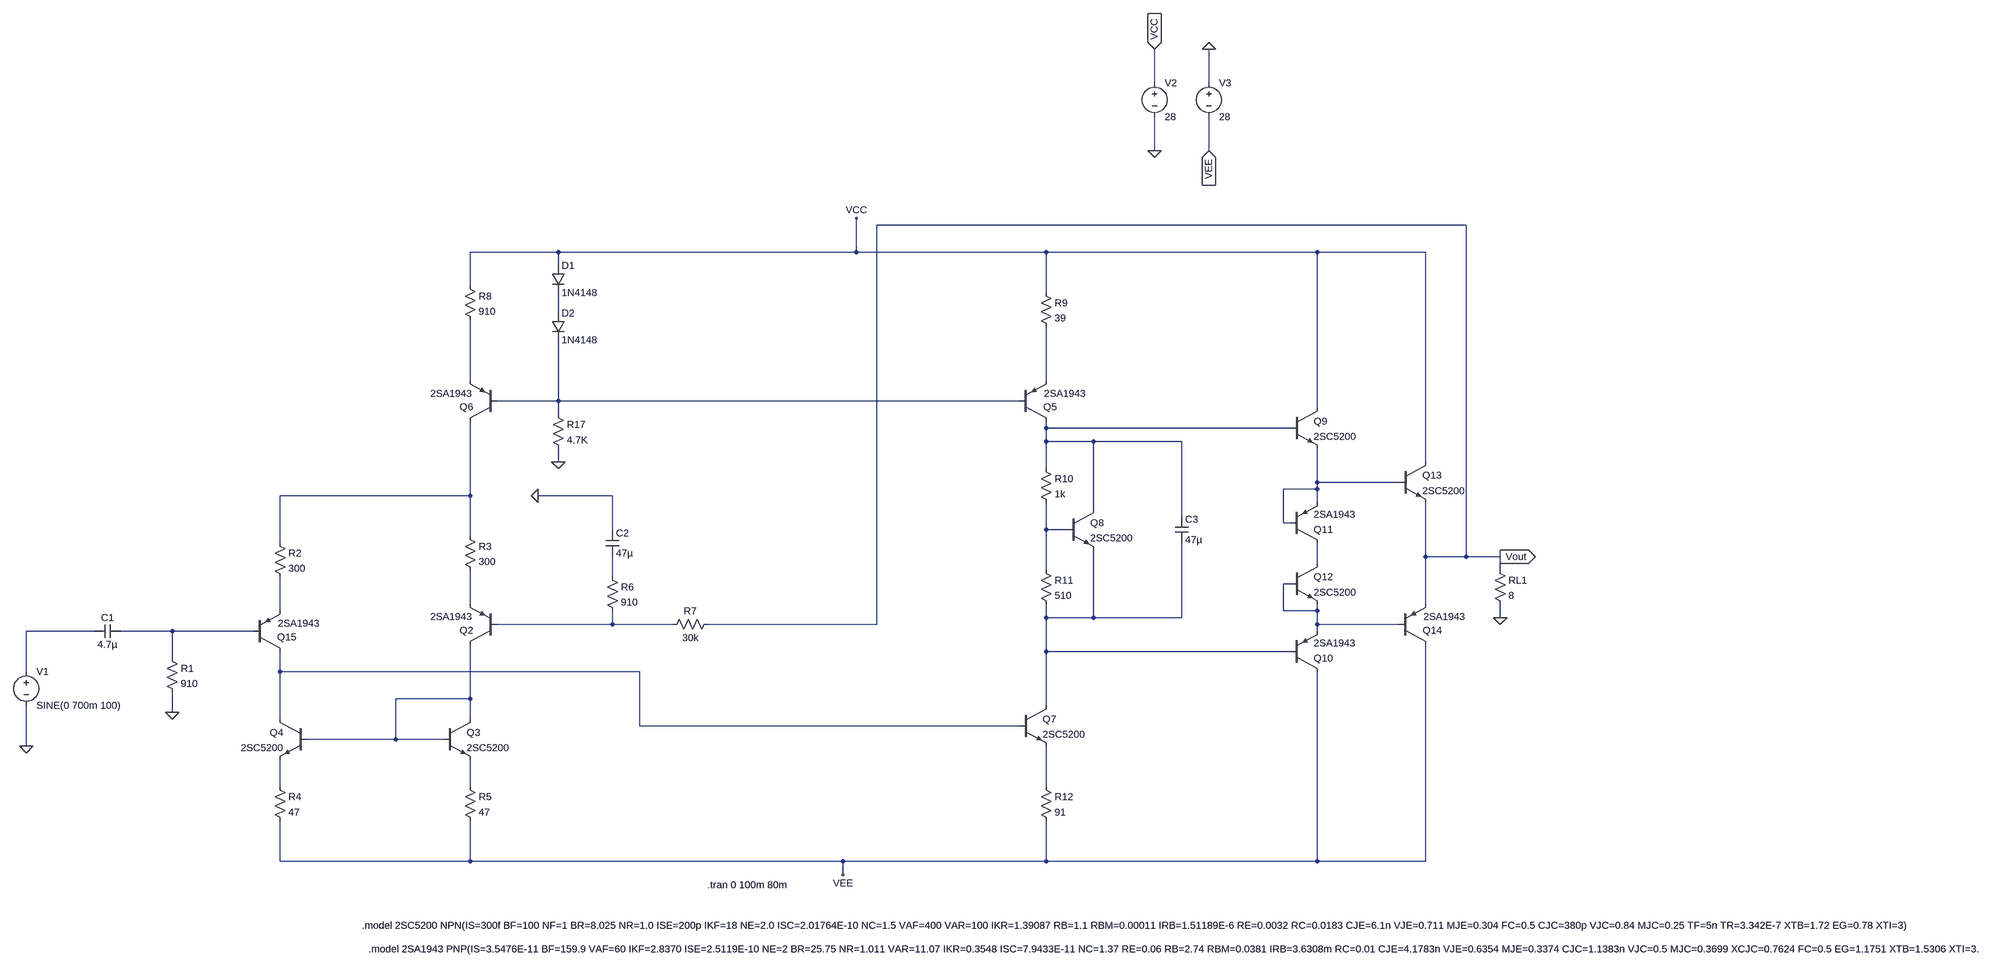
[diagram p0: schematic POWER_AMP_GroupC.asc]
POWER_AMP_GroupC.asc, the LTspice schematic file:
Version 4.1
SHEET 1 5060 688
WIRE 2816 -1376 2816 -1456
WIRE 2944 -1376 2944 -1456
WIRE 2816 -1216 2816 -1296
WIRE 2944 -1216 2944 -1296
WIRE 3552 -1040 2160 -1040
WIRE 1408 -976 1200 -976
WIRE 2112 -976 2112 -1056
WIRE 2112 -976 1408 -976
WIRE 2560 -976 2112 -976
WIRE 3200 -976 2560 -976
WIRE 3456 -976 3200 -976
WIRE 1408 -944 1408 -976
WIRE 1200 -896 1200 -976
WIRE 2560 -880 2560 -976
WIRE 1408 -832 1408 -880
WIRE 1200 -672 1200 -816
WIRE 2560 -672 2560 -800
WIRE 1408 -624 1408 -768
WIRE 1408 -624 1264 -624
WIRE 2496 -624 1408 -624
WIRE 3200 -608 3200 -976
WIRE 1408 -592 1408 -624
WIRE 2560 -560 2560 -576
WIRE 3136 -560 2560 -560
WIRE 2560 -528 2560 -560
WIRE 2672 -528 2560 -528
WIRE 2880 -528 2672 -528
WIRE 1408 -480 1408 -512
WIRE 3456 -480 3456 -976
WIRE 2560 -464 2560 -528
WIRE 3200 -432 3200 -512
WIRE 3392 -432 3200 -432
WIRE 3200 -416 3200 -432
WIRE 3200 -416 3120 -416
WIRE 1200 -400 1200 -576
WIRE 1200 -400 736 -400
WIRE 1536 -400 1360 -400
WIRE 3200 -384 3200 -416
WIRE 2672 -368 2672 -528
WIRE 2880 -352 2880 -528
WIRE 3120 -336 3120 -416
WIRE 3136 -336 3120 -336
WIRE 1536 -320 1536 -400
WIRE 2560 -320 2560 -384
WIRE 2608 -320 2560 -320
WIRE 1200 -304 1200 -400
WIRE 736 -288 736 -400
WIRE 3456 -256 3456 -384
WIRE 3552 -256 3552 -1040
WIRE 3552 -256 3456 -256
WIRE 3632 -256 3552 -256
WIRE 3200 -240 3200 -288
WIRE 2560 -224 2560 -320
WIRE 3632 -224 3632 -256
WIRE 1536 -208 1536 -256
WIRE 3136 -192 3120 -192
WIRE 1200 -144 1200 -224
WIRE 3456 -144 3456 -256
WIRE 736 -128 736 -208
WIRE 3120 -128 3120 -192
WIRE 3200 -128 3200 -144
WIRE 3200 -128 3120 -128
WIRE 2560 -112 2560 -144
WIRE 2672 -112 2672 -272
WIRE 2672 -112 2560 -112
WIRE 2880 -112 2880 -288
WIRE 2880 -112 2672 -112
WIRE 3632 -112 3632 -144
WIRE 1536 -96 1536 -128
WIRE 1536 -96 1264 -96
WIRE 1680 -96 1536 -96
WIRE 2160 -96 2160 -1040
WIRE 2160 -96 1760 -96
WIRE 3200 -96 3200 -128
WIRE 3392 -96 3200 -96
WIRE 160 -80 0 -80
WIRE 368 -80 224 -80
WIRE 672 -80 368 -80
WIRE 3200 -80 3200 -96
WIRE 2560 -32 2560 -112
WIRE 3136 -32 2560 -32
WIRE 368 -16 368 -80
WIRE 0 16 0 -80
WIRE 736 16 736 -32
WIRE 1600 16 736 16
WIRE 1200 80 1200 -48
WIRE 1200 80 1024 80
WIRE 2560 96 2560 -32
WIRE 368 112 368 64
WIRE 736 128 736 16
WIRE 1200 128 1200 80
WIRE 1600 144 1600 16
WIRE 2496 144 1600 144
WIRE 1024 176 1024 80
WIRE 1024 176 800 176
WIRE 1136 176 1024 176
WIRE 0 192 0 96
WIRE 736 288 736 224
WIRE 1200 288 1200 224
WIRE 2560 288 2560 192
WIRE 736 464 736 368
WIRE 1200 464 1200 368
WIRE 1200 464 736 464
WIRE 2080 464 1200 464
WIRE 2560 464 2560 368
WIRE 2560 464 2080 464
WIRE 3200 464 3200 16
WIRE 3200 464 2560 464
WIRE 3456 464 3456 -48
WIRE 3456 464 3200 464
WIRE 2080 496 2080 464
FLAG 0 192 0
FLAG 368 112 0
FLAG 1360 -400 0
FLAG 2112 -1056 VCC
FLAG 2080 496 VEE
FLAG 2816 -1216 0
FLAG 2944 -1456 0
FLAG 2816 -1456 VCC
IOPIN 2816 -1456 In
FLAG 2944 -1216 VEE
IOPIN 2944 -1216 In
FLAG 1408 -480 0
FLAG 3632 -112 0
FLAG 3632 -256 Vout
IOPIN 3632 -256 Out
SYMBOL voltage 0 0 R0
WINDOW 123 0 0 Left 0
WINDOW 39 0 0 Left 0
SYMATTR InstName V1
SYMATTR Value SINE(0 700m 100)
SYMBOL cap 224 -96 R90
WINDOW 0 0 32 VBottom 2
WINDOW 3 32 32 VTop 2
SYMATTR InstName C1
SYMATTR Value 4.7µ
SYMBOL res 352 -32 R0
SYMATTR InstName R1
SYMATTR Value 910
SYMBOL res 720 -304 R0
SYMATTR InstName R2
SYMATTR Value 300
SYMBOL res 1184 -320 R0
SYMATTR InstName R3
SYMATTR Value 300
SYMBOL npn 1136 128 R0
SYMATTR InstName Q3
SYMATTR Value 2SC5200
SYMBOL npn 800 128 M0
SYMATTR InstName Q4
SYMATTR Value 2SC5200
SYMBOL res 720 272 R0
SYMATTR InstName R4
SYMATTR Value 47
SYMBOL res 1184 272 R0
SYMATTR InstName R5
SYMATTR Value 47
SYMBOL res 1520 -224 R0
SYMATTR InstName R6
SYMATTR Value 910
SYMBOL cap 1520 -320 R0
SYMATTR InstName C2
SYMATTR Value 47µ
SYMBOL res 1776 -112 R90
WINDOW 0 0 56 VBottom 2
WINDOW 3 32 56 VTop 2
SYMATTR InstName R7
SYMATTR Value 30k
SYMBOL res 1184 -912 R0
SYMATTR InstName R8
SYMATTR Value 910
SYMBOL diode 1392 -944 R0
SYMATTR InstName D1
SYMATTR Value 1N4148
SYMBOL diode 1392 -832 R0
SYMATTR InstName D2
SYMATTR Value 1N4148
SYMBOL res 2544 -896 R0
SYMATTR InstName R9
SYMATTR Value 39
SYMBOL res 2544 -480 R0
SYMATTR InstName R10
SYMATTR Value 1k
SYMBOL res 2544 -240 R0
SYMATTR InstName R11
SYMATTR Value 510
SYMBOL npn 2496 96 R0
SYMATTR InstName Q7
SYMATTR Value 2SC5200
SYMBOL npn 2608 -368 R0
SYMATTR InstName Q8
SYMATTR Value 2SC5200
SYMBOL cap 2864 -352 R0
SYMATTR InstName C3
SYMATTR Value 47µ
SYMBOL res 2544 272 R0
SYMATTR InstName R12
SYMATTR Value 91
SYMBOL voltage 2816 -1392 R0
WINDOW 123 0 0 Left 0
WINDOW 39 0 0 Left 0
SYMATTR InstName V2
SYMATTR Value 28
SYMBOL voltage 2944 -1392 R0
WINDOW 123 0 0 Left 0
WINDOW 39 0 0 Left 0
SYMATTR InstName V3
SYMATTR Value 28
SYMBOL npn 3136 -608 R0
SYMATTR InstName Q9
SYMATTR Value 2SC5200
SYMBOL pnp 3136 16 M180
SYMATTR InstName Q10
SYMATTR Value 2SA1943
SYMBOL res 1392 -608 R0
SYMATTR InstName R17
SYMATTR Value 4.7K
SYMBOL npn 3392 -480 R0
SYMATTR InstName Q13
SYMATTR Value 2SC5200
SYMBOL pnp 3392 -48 M180
WINDOW 0 57 34 Left 2
WINDOW 3 59 66 Left 2
SYMATTR InstName Q14
SYMATTR Value 2SA1943
SYMBOL res 3616 -240 R0
SYMATTR InstName RL1
SYMATTR Value 8
SYMBOL pnp 3136 -288 M180
SYMATTR InstName Q11
SYMATTR Value 2SA1943
SYMBOL npn 3136 -240 R0
SYMATTR InstName Q12
SYMATTR Value 2SC5200
SYMBOL pnp 2496 -576 M180
WINDOW 0 57 34 Left 2
WINDOW 3 59 66 Left 2
SYMATTR InstName Q5
SYMATTR Value 2SA1943
SYMBOL pnp 1264 -576 R180
WINDOW 0 57 34 Left 2
WINDOW 3 59 66 Left 2
SYMATTR InstName Q6
SYMATTR Value 2SA1943
SYMBOL pnp 1264 -48 R180
WINDOW 0 57 34 Left 2
WINDOW 3 59 66 Left 2
SYMATTR InstName Q2
SYMATTR Value 2SA1943
SYMBOL pnp 672 -32 M180
WINDOW 0 57 34 Left 2
WINDOW 3 59 66 Left 2
SYMATTR InstName Q15
SYMATTR Value 2SA1943
TEXT 944 616 Left 2 !.model 2SC5200 NPN(IS=300f BF=100 NF=1 BR=8.025 NR=1.0 ISE=200p IKF=18 NE=2.0 ISC=2.01764E-10 NC=1.5 VAF=400 VAR=100 IKR=1.39087 RB=1.1 RBM=0.00011 IRB=1.51189E-6 RE=0.0032 RC=0.0183 CJE=6.1n VJE=0.711 MJE=0.304 FC=0.5 CJC=380p VJC=0.84 MJC=0.25 TF=5n TR=3.342E-7 XTB=1.72 EG=0.78 XTI=3)
TEXT 1760 520 Left 2 !.tran 0 100m 80m
TEXT 960 672 Left 2 !.model 2SA1943 PNP(IS=3.5476E-11 BF=159.9 VAF=60 IKF=2.8370 ISE=2.5119E-10 NE=2 BR=25.75 NR=1.011 VAR=11.07 IKR=0.3548 ISC=7.9433E-11 NC=1.37 RE=0.06 RB=2.74 RBM=0.0381 IRB=3.6308m RC=0.01 CJE=4.1783n VJE=0.6354 MJE=0.3374 CJC=1.1383n VJC=0.5 MJC=0.3699 XCJC=0.7624 FC=0.5 EG=1.1751 XTB=1.5306 XTI=3.0)

The netlist it stands for:
* POWER_AMP_GroupC.asc
V1 N016 0 SINE(0 700m 100)
C1 N017 N016 4.7µ
R1 N017 0 910
R2 N007 N013 300
R3 N007 N012 300
Q3 N019 N019 N021 0 2SC5200
Q4 N018 N019 N020 0 2SC5200
R4 N020 VEE 47
R5 N021 VEE 47
R6 N010 N015 910
C2 0 N010 47µ
R7 Vout N015 30k
R8 VCC N002 910
D1 VCC N001 1N4148
D2 N001 N004 1N4148
R9 VCC N003 39
R10 N005 N008 1k
R11 N008 N014 510
Q7 N014 N018 N022 0 2SC5200
Q8 N005 N008 N014 0 2SC5200
C3 N005 N014 47µ
R12 N022 VEE 91
V2 VCC 0 28
V3 0 VEE 28
Q9 VCC N005 N006 0 2SC5200
Q10 VEE N014 N011 0 2SA1943
R17 N004 0 4.7K
Q13 VCC N006 Vout 0 2SC5200
Q14 VEE N011 Vout 0 2SA1943
RL1 Vout 0 8
Q11 N009 N006 N006 0 2SA1943
Q12 N009 N011 N011 0 2SC5200
Q5 N005 N004 N003 0 2SA1943
Q6 N007 N004 N002 0 2SA1943
Q2 N019 N015 N012 0 2SA1943
Q15 N018 N017 N013 0 2SA1943
.model D D
.lib standard.dio
.model NPN NPN
.model PNP PNP
.lib standard.bjt
.model 2SC5200 NPN(IS=300f BF=100 NF=1 BR=8.025 NR=1.0 ISE=200p IKF=18 NE=2.0 ISC=2.01764E-10 NC=1.5 VAF=400 VAR=100 IKR=1.39087 RB=1.1 RBM=0.00011 IRB=1.51189E-6 RE=0.0032 RC=0.0183 CJE=6.1n VJE=0.711 MJE=0.304 FC=0.5 CJC=380p VJC=0.84 MJC=0.25 TF=5n TR=3.342E-7 XTB=1.72 EG=0.78 XTI=3)
.tran 0 100m 80m
.model 2SA1943 PNP(IS=3.5476E-11 BF=159.9 VAF=60 IKF=2.8370 ISE=2.5119E-10 NE=2 BR=25.75 NR=1.011 VAR=11.07 IKR=0.3548 ISC=7.9433E-11 NC=1.37 RE=0.06 RB=2.74 RBM=0.0381 IRB=3.6308m RC=0.01 CJE=4.1783n VJE=0.6354 MJE=0.3374 CJC=1.1383n VJC=0.5 MJC=0.3699 XCJC=0.7624 FC=0.5 EG=1.1751 XTB=1.5306 XTI=3.0)
.backanno
.end